# EAGLE design schematic (EAGLE 5.10)
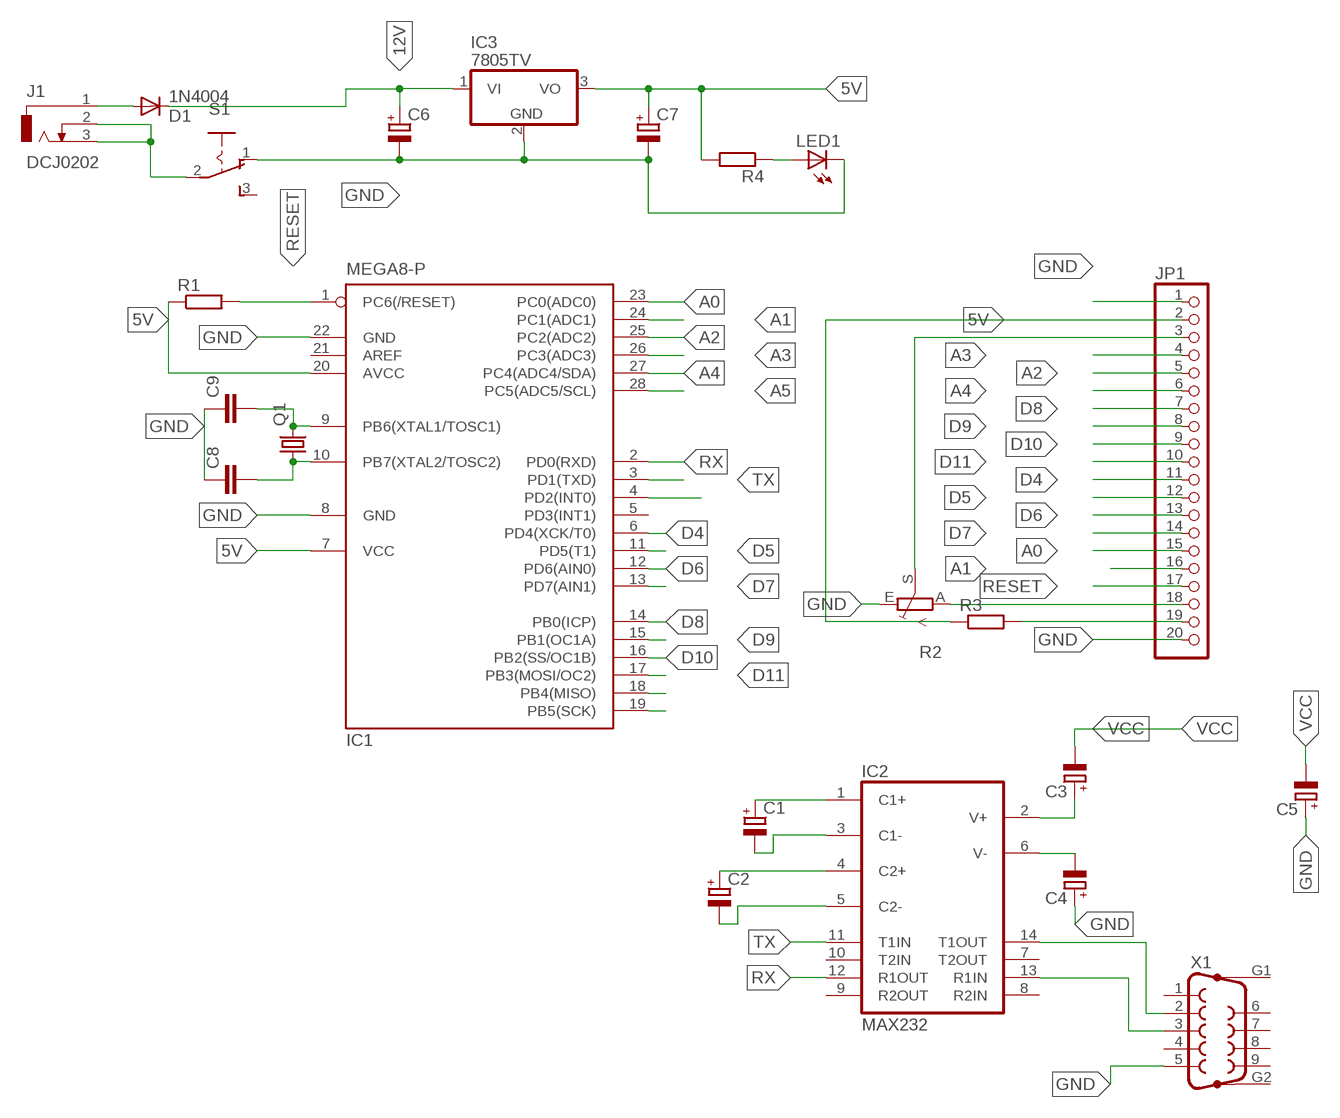
[diagram p0: schematic, sheet 1]

## Parts
C1  CPOL-EUE2-5  [E2-5]
C2  CPOL-EUE2-5  [E2-5]
C3  CPOL-EUE2-5  [E2-5]
C4  CPOL-EUE2-5  [E2-5]
C5  CPOL-EUE2-5  [E2-5]
C6  CPOL-EUE5-6  [E5-6]
C7  CPOL-EUE5-6  [E5-6]
C8  C-EU025-024X044  [C025-024X044]
C9  C-EU025-024X044  [C025-024X044]
D1  1N4004  [DO41-10]
IC1  MEGA8-P  [DIL28-3]
IC2  MAX232  [DIL16]
IC3  7805TV  [TO220V]
J1  DCJ0202  [DCJ0202]
JP1  PINHD-1X20  [1X20]
LED1  LED3MM  [LED3MM]
Q1  CRYSTALHC49S  [HC49/S]
R1  R-EU_0207/10  [0207/10]
R2  TRIM_EU-B64Y  [B64Y]
R3  R-EU_0207/10  [0207/10]
R4  R-EU_0207/10  [0207/10]
S1  255SB  [255SB]
X1  F09HP  [F09HP]

## Nets
5V: C7.+ IC1.7(VCC) IC1.20(AVCC) IC3.3(VO) JP1.2 R1.1 R3.1 R4.2
12V: C6.+ D1.C IC3.1(VI)
A0: IC1.23(PC0(ADC0)) JP1.15
A1: IC1.24(PC1(ADC1)) JP1.16
A2: IC1.25(PC2(ADC2)) JP1.5
A3: IC1.26(PC3(ADC3)) JP1.4
A4: IC1.27(PC4(ADC4/SDA)) JP1.6
A5: IC1.28(PC5(ADC5/SCL))
D4: IC1.6(PD4(XCK/T0)) JP1.11
D5: IC1.11(PD5(T1)) JP1.12
D6: IC1.12(PD6(AIN0)) JP1.13
D7: IC1.13(PD7(AIN1)) JP1.14
D8: IC1.14(PB0(ICP)) JP1.7
D9: IC1.15(PB1(OC1A)) JP1.8
D10: IC1.16(PB2(SS/OC1B)) JP1.9
D11: IC1.17(PB3(MOSI/OC2)) JP1.10
GND: C4.+ C5.+ C6.- C7.- C8.1 C9.1 IC1.8(GND) IC1.22(GND) IC3.2(GND) JP1.1 JP1.20 LED1.K(C) R2.E S1.1(O) X1.5
N$1: C9.2 IC1.9(PB6(XTAL1/TOSC1)) Q1.2
N$2: C8.2 IC1.10(PB7(XTAL2/TOSC2)) Q1.1
N$3: C2.- IC2.5(C2-)
N$4: C2.+ IC2.4(C2+)
N$5: C1.- IC2.3(C1-)
N$6: C1.+ IC2.1(C1+)
N$7: C3.+ IC2.2(V+)
N$8: C4.- IC2.6(V-)
N$9: IC2.14(T1OUT) X1.2
N$10: IC2.13(R1IN) X1.3
N$11: D1.A J1.1
N$12: IC1.4(PD2(INT0))
N$13: LED1.A R4.1
N$15: J1.2 J1.3 S1.2(P)
N$21: JP1.18 R2.A
N$22: JP1.19 R3.2
N$24: IC1.18(PB4(MISO))
N$25: IC1.19(PB5(SCK))
POTOUT: JP1.3 R2.S
RESET: IC1.1(PC6(/RESET)) JP1.17 R1.2
RX: IC1.2(PD0(RXD)) IC2.12(R1OUT)
TX: IC1.3(PD1(TXD)) IC2.11(T1IN)
VCC: C3.- C5.-
Unconnected: IC1.5(PD3(INT1)) IC1.21(AREF) IC2.7(T2OUT) IC2.8(R2IN) IC2.9(R2OUT) IC2.10(T2IN) S1.3(S) X1.1 X1.4 X1.6 X1.7 X1.8 X1.9 X1.G1 X1.G2

## Power pins joined to a net without a drawn wire
GND: IC2.15(GND)
VCC: IC2.16(VCC)

## Library data of the parts
C1-C7 = rcl:CPOL-EU: POLARIZED CAPACITOR, European symbol
C8 C9 = rcl:C-EU: CAPACITOR, European symbol
D1 = diode:1N4004: DIODE general purpose rectifier, 1 A
IC1 = atmel:MEGA8-P: MICROCONTROLLER 8 Kbytes FLASH, 1 kbytes SRAM, 512 bytes EEPROM, USART, 4-channel 10 bit ADC, 2-channel 8 bit ADC Pin compatible with Atmega48, ATMega88, ATMega168 Source: avr.lbr
IC2 = maxim:MAX232: RS232 TRANSEIVER
IC3 = linear:78*: Positive VOLTAGE REGULATOR Source: http://cache.national.com/ds/LM/LM78L05.pdf http://www.fairchildsemi.com/ds/LM/LM7805.pdf
J1 = con-jack:DCJ0202: DC POWER JACK Source: DCJ0202.pdf
JP1 = pinhead:PINHD-1X20: PIN HEADER
LED1 = led:LED: LED OSRAM: - CHIPLED LG R971, LG N971, LY N971, LG Q971, LY Q971, LO R971, LY R971 LH N974, LH R974 LS Q976, LO Q976, LY Q976 LO Q996 - Hyper CHIPLED LW Q18S LB Q993, LB Q99A, LB R99A - SideLED LS A670, LO A670, LY A670, LG A670, LP A670 LB A673, LV A673, LT A673, LW A673 LH A674 LY A675 LS A676, LA A676, LO A676, LY A676, LW A676 LS A679, LY A679, LG A679 - Hyper Micro SIDELED® LS Y876, LA Y876, LO Y876, LY Y876 LT Y87S - SmartLED LW L88C, LW L88S LB L89C, LB L89S, LG L890 LS L89K, LO L89K, LY L89K LS L896, LA L896, LO L896, LY L896 - TOPLED LS T670, LO T670, LY T670, LG T670, LP T670 LSG T670, LSP T670, LSY T670, LOP T670, LYG T670 LG T671, LOG T671, LSG T671 LB T673, LV T673, LT T673, LW T673 LH T674 LS T676, LA T676, LO T676, LY T676, LB T676, LH T676, LSB T676, LW T676 LB T67C, LV T67C, LT T67C, LS T67K, LO T67K, LY T67K, LW E67C LS E67B, LA E67B, LO E67B, LY E67B, LB E67C, LV E67C, LT E67C LW T67C LS T679, LY T679, LG T679 LS T770, LO T770, LY T770, LG T770, LP T770 LB T773, LV T773, LT T773, LW T773 LH T774 LS E675, LA E675, LY E675, LS T675 LS T776, LA T776, LO T776, LY T776, LB T776 LHGB T686 LT T68C, LB T68C - Hyper Mini TOPLED® LB M676 - Mini TOPLED Santana® LG M470 LS M47K, LO M47K, LY M47K Source: http://www.osram.convergy.de LUXEON: - LUMILED® LXK2-PW12-R00, LXK2-PW12-S00, LXK2-PW14-U00, LXK2-PW14-V00 LXK2-PM12-R00, LXK2-PM12-S00, LXK2-PM14-U00 LXK2-PE12-Q00, LXK2-PE12-R00, LXK2-PE12-S00, LXK2-PE14-T00, LXK2-PE14-U00 LXK2-PB12-K00, LXK2-PB12-L00, LXK2-PB12-M00, LXK2-PB14-N00, LXK2-PB14-P00, LXK2-PB14-Q00 LXK2-PR12-L00, LXK2-PR12-M00, LXK2-PR14-Q00, LXK2-PR14-R00 LXK2-PD12-Q00, LXK2-PD12-R00, LXK2-PD12-S00 LXK2-PH12-R00, LXK2-PH12-S00 LXK2-PL12-P00, LXK2-PL12-Q00, LXK2-PL12-R00 Source: www.luxeon.com KINGBRIGHT: KA-3528ASYC Source: www.kingbright.com
Q1 = crystal:CRYSTAL: CRYSTAL
R1 R3 R4 = rcl:R-EU_: RESISTOR, European symbol
R2 = pot:TRIM_EU-: POTENTIOMETER
S1 = switch:255SB: SLIDING SWITCH Distributor Buerklin, 11G810
X1 = con-subd:F09HP: SUB-D

## Board
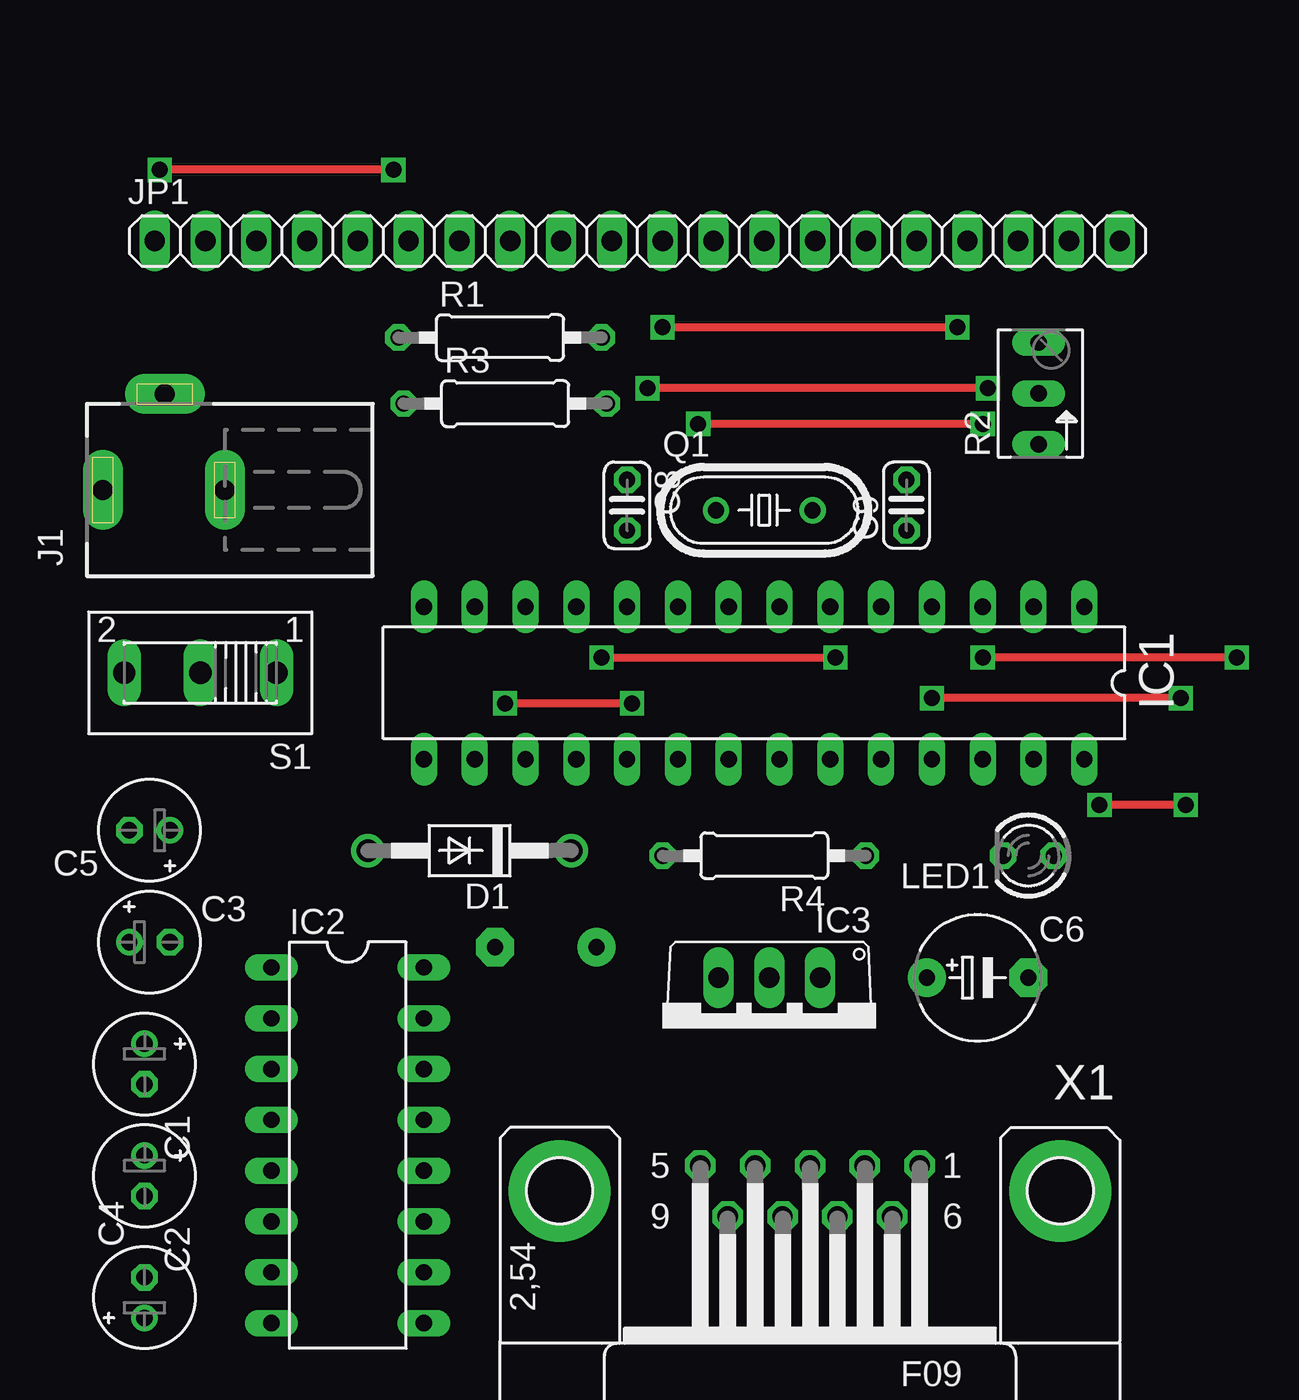
[diagram p1: board, top side]
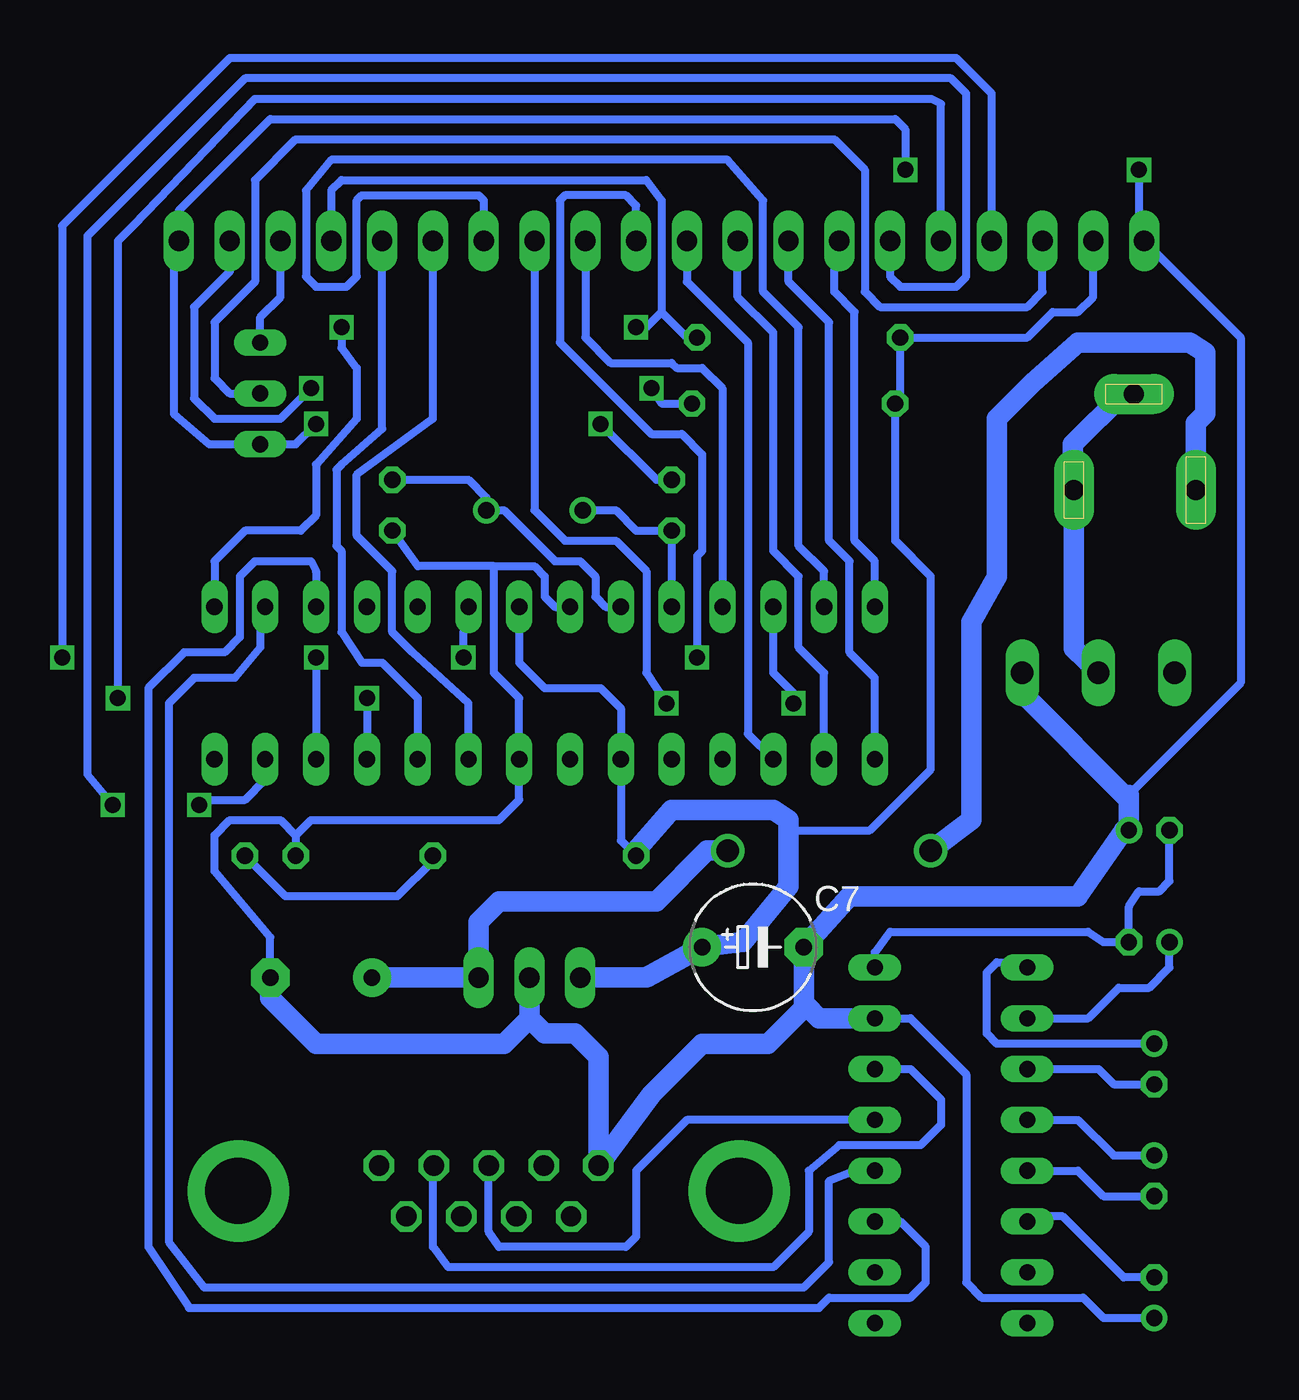
[diagram p2: board, bottom side, seen from below]

No outline drawn. Coordinates in mm, seen from the top.
Copper layers (1*16): Top 0.035mm / dielectric 1.5mm / Bottom 0.035mm
Design rules "default": minimum track width 10mil, minimum drill 24mil, track to track 8mil, track to pad 8mil, pad to pad 8mil, via to via 8mil, smd to smd 8mil, copper to edge 40mil, drill to drill 8mil, minimum pad ring 10mil, minimum via ring 8mil, stop-mask expansion 4mil, vias tented up to drill 0mil, thermal gap 10mil

### Footprints (pad centres in the part's own frame; a part is rotated, then mirrored left to right if it is on the bottom)
E2-5 = drill 0.813 pad 1.27 round: + -1.016,0 | drill 0.813 pad 1.27 octagon: - 1.016,0
E5-6 = drill 0.813 pad 1.905 round: + -2.54,0 | drill 0.813 pad 1.905 octagon: - 2.54,0
C025-024X044 = drill 0.813 octagon: 1 -1.27,0; 2 1.27,0
DO41-10 = drill 1.118 round: A 5.08,0; C -5.08,0
DIL28-3 = drill 0.813 long: 1 -16.51,-3.81; 2 -13.97,-3.81; 3 -11.43,-3.81; 4 -8.89,-3.81; 5 -6.35,-3.81; 6 -3.81,-3.81; 7 -1.27,-3.81; 8 1.27,-3.81; 9 3.81,-3.81; 10 6.35,-3.81; 11 8.89,-3.81; 12 11.43,-3.81; 13 13.97,-3.81; 14 16.51,-3.81; 15 16.51,3.81; 16 13.97,3.81; 17 11.43,3.81; 18 8.89,3.81; 19 6.35,3.81; 20 3.81,3.81; 21 1.27,3.81; 22 -1.27,3.81; 23 -3.81,3.81; 24 -6.35,3.81; 25 -8.89,3.81; 26 -11.43,3.81; 27 -13.97,3.81; 28 -16.51,3.81
DIL16 = drill 0.813 long: 1 -8.89,-3.81; 2 -6.35,-3.81; 3 -3.81,-3.81; 4 -1.27,-3.81; 5 1.27,-3.81; 6 3.81,-3.81; 7 6.35,-3.81; 8 8.89,-3.81; 9 8.89,3.81; 10 6.35,3.81; 11 3.81,3.81; 12 1.27,3.81; 13 -1.27,3.81; 14 -3.81,3.81; 15 -6.35,3.81; 16 -8.89,3.81
TO220V = drill 1.016 long: 1 -2.54,-2.54; 2 0,-2.54; 3 2.54,-2.54
DCJ0202 = drill 1 pad 2 long: 1 0,3.1; 2 4.8,0; 3 0,-3
1X20 = drill 1.016 long: 1 -24.13,0; 2 -21.59,0; 3 -19.05,0; 4 -16.51,0; 5 -13.97,0; 6 -11.43,0; 7 -8.89,0; 8 -6.35,0; 9 -3.81,0; 10 -1.27,0; 11 1.27,0; 12 3.81,0; 13 6.35,0; 14 8.89,0; 15 11.43,0; 16 13.97,0; 17 16.51,0; 18 19.05,0; 19 21.59,0; 20 24.13,0
LED3MM = drill 0.813 octagon: A -1.27,0; K 1.27,0
HC49/S = drill 0.813 round: 1 -2.413,0; 2 2.413,0
0207/10 = drill 0.813 octagon: 1 -5.08,0; 2 5.08,0
B64Y = drill 0.813 long: A 2.54,0; E -2.54,0; S 0,0
255SB = drill 1.118 long: 1 -3.81,0; 2 0,0; 3 3.81,0
F09HP = drill 1.016 octagon: 1 -5.486,-1.27; 2 -2.743,-1.27; 3 0,-1.27; 4 2.743,-1.27; 5 5.486,-1.27; 6 -4.115,1.27; 7 -1.372,1.27; 8 1.372,1.27; 9 4.115,1.27 | drill 3.302 pad 5.08 round: G1 -12.522,0; G2 12.522,0

### Placement (x,y rotation side)
C1  -155.45,33.53 270 top
C2  -155.45,27.94 270 top
C3  -155.19,39.62 0 top
C4  -155.45,21.84 90 top
C5  -155.19,45.21 180 top
C6  -113.79,37.85 0 top
C7  -135.38,39.37 0 bottom
C8  -131.32,61.47 270 top
C9  -117.35,61.47 90 top
D1  -139.19,44.2 180 top
IC1  -124.97,52.58 180 top
IC2  -145.29,29.46 270 top
IC3  -124.21,35.31 180 top
J1  -154.43,62.23 90 top
JP1  -130.81,74.68 0 top
LED1  -111.25,43.94 180 top
Q1  -124.46,61.21 0 top
R1  -137.67,69.85 0 top
R2  -110.74,67.06 90 top
R3  -137.41,66.55 0 top
R4  -124.46,43.94 180 top
S1  -152.65,53.09 180 top
X1  -122.17,27.18 180 top

### Tracks (layer width: path | path; a pad name or v marks a point on that pad's centre or on a via)
5V
  Bottom 0.406: IC1.7 -123.7,53.59 -124.97,52.32 -127.76,52.32 -128.78,51.31 IC1.20 -128.78,44.7 R4.2 | JP1.2 -152.4,71.88 -151.64,71.12 -150.37,71.12 -149.1,69.85 R1.1 -142.75,66.8 R3.1 -142.49,59.69 -144.27,57.91 -144.27,48.26 -141.22,45.21 -137.41,45.21 -137.16,44.96
  Bottom 1.016: IC3.3 -130.05,37.85 C7.+ -134.87,39.62 -137.16,42.42 -137.16,44.96 -137.16,45.72 -136.4,46.23 -131.32,46.23 -129.54,44.2 R4.2
12V
  Bottom 1.016: C6.+ IC3.1 -121.67,40.64 -122.68,41.66 -130.56,41.66 -133.1,44.2 D1.C
A0
  Bottom 0.406: -119.38,75.18 JP1.15 -119.38,65.79 -115.57,62.99 -115.57,59.94 -117.35,58.17 -117.35,55.12 -118.36,54.1 -121.16,51.56 IC1.23
A1
  Bottom 0.406: IC1.24 -118.62,51.82 -116.84,53.59 -115.82,53.59 -114.81,55.12 -114.81,59.18 -114.55,59.44 -114.55,63.25 -114.81,63.5 -116.84,65.28 JP1.16
A2  (via drill 0.8)
  Top 0.406: v-103.63,51.82 v-116.08,51.82
  Bottom 0.406: v-116.08,51.82 IC1.25 | v-103.63,51.82 -103.63,74.68 -104.39,75.44 -110.49,81.79 -144.27,81.79 -144.78,81.53 JP1.5
A3  (via drill 0.8)
  Top 0.406: v-100.84,53.85 v-113.54,53.85
  Bottom 0.406: JP1.4 -147.32,82.04 -145.54,83.82 -109.22,83.82 -100.84,75.44 v-100.84,53.85 | v-113.54,53.85 IC1.26
A4  (via drill 0.8)
  Top 0.406: v-103.38,46.48 v-107.7,46.48
  Bottom 0.406: JP1.6 -142.24,72.9 -142.75,72.39 -145.54,72.39 -146.05,72.9 -146.05,82.04 -145.29,82.8 -109.98,82.8 -102.11,74.93 -102.11,48.01 v-103.38,46.48 | v-107.7,46.48 -107.95,46.74 -109.98,46.74 -111,47.75 IC1.27
D4  (via drill 0.8)
  Top 0.406: v-132.59,53.85 v-120.9,53.85
  Bottom 0.406: JP1.11 -129.54,76.45 -129.03,76.96 -125.98,76.96 -125.73,76.71 -125.73,69.6 -130.3,65.02 -131.83,65.02 -132.84,64.01 -132.84,59.18 -132.59,58.93 v-132.59,53.85 | v-120.9,53.85 -120.9,55.12 -121.16,55.37 IC1.6
D5
  Bottom 0.406: IC1.11 -133.86,67.31 -132.84,68.33 -131.57,68.33 -131.32,68.58 -128.27,68.58 -127,69.85 JP1.12
D6  (via drill 0.8)
  Top 0.406: v-131.06,51.56 v-137.41,51.56
  Bottom 0.406: JP1.13 -124.46,61.21 -125.98,59.69 -128.52,59.69 -130.05,58.17 -130.05,53.09 v-131.06,51.56 | v-137.41,51.56 -137.41,52.07 -136.4,53.09 IC1.12
D7
  Bottom 0.406: IC1.13 -138.94,58.17 -137.67,59.44 -137.67,70.36 -135.89,72.14 -135.89,76.71 -134.11,78.74 -114.3,78.74 -113.03,77.22 -113.03,72.9 -113.54,72.39 -115.06,72.39 -115.57,72.9 -115.57,76.71 -115.82,76.96 -121.67,76.96 -121.92,76.71 JP1.14
D8
  Bottom 0.406: IC1.14 -141.48,58.67 -140.46,59.69 -140.46,71.12 -139.45,72.14 -139.45,74.42 JP1.7
D9
  Bottom 0.406: IC1.15 -141.48,52.83 -140.21,54.1 -140.21,58.67 -139.19,59.69 -139.19,70.61 -137.16,72.64 JP1.8
D10
  Bottom 0.406: IC1.16 -138.94,53.09 -137.67,54.36 -137.67,57.91 -136.4,59.18 -136.4,70.1 -134.62,71.88 JP1.9
D11
  Bottom 0.406: JP1.10 -132.08,72.64 -135.13,69.6 -135.13,50.04 IC1.17
GND  (via drill 0.8)
  Top 0.406: v-113.54,65.53 v-127.76,65.53 | v-143,78.23 v-154.69,78.23
  Bottom 0.406: -122.43,58.42 -118.62,58.42 C9.1 | C6.- -111.25,39.88 -108.46,43.18 -108.46,44.96 -109.22,45.72 -111.76,45.72 -112.52,44.96 | -112.52,44.96 LED1.K | -112.52,44.96 -113.28,45.72 -122.68,45.72 -123.7,46.74 IC1.22 -123.7,51.82 -122.43,53.09 -122.43,58.42 | -154.18,46.99 -159.77,52.58 -159.77,69.85 JP1.1 -154.69,74.93 v-154.69,78.23 | C8.1 -130.56,62.74 v-127.76,65.53 | v-113.54,65.53 -112.52,64.52 R2.E -108.2,64.52 -106.43,66.04 -106.43,74.17 JP1.20 -106.68,76.2 -111.25,80.77 -142.49,80.77 -143,80.26 v-143,78.23 | IC1.8 -125.48,56.39 -124.97,56.9 -124.97,57.91 -124.46,58.42 -122.43,58.42 | C4.+ -152.91,20.83 -151.89,21.84 -146.81,21.84 -146.05,22.61 -146.05,33.02 -143.26,35.81 -140.97,35.81
  Bottom 1.016: S1.1 -148.84,52.07 -154.18,46.74 | -154.18,46.74 C5.+ -153.92,45.21 -151.64,41.91 -140.21,41.91 C7.- -137.92,36.58 -138.05,36.45 | -154.18,46.99 -154.18,46.74 | -138.05,36.45 -138.68,35.81 -140.97,35.81 IC2.15 | -138.05,36.45 -136.14,34.54 -132.84,34.54 -130.3,32 X1.5 -127.66,33.88 -126.49,35.05 -124.97,35.05 -124.21,35.81 | -124.21,35.81 IC3.2 | -124.21,35.81 -122.94,34.54 -113.54,34.54 -111.25,36.83 C6.-
N$1
  Bottom 0.406: C9.2 -121.16,62.74 -122.05,61.85 Q1.2 -122.94,61.21 -125.48,58.67 -126.75,58.67 -127.51,57.91 -127.51,56.9 -128.02,56.39 IC1.9
N$2
  Bottom 0.406: Q1.1 -128.52,61.21 -129.54,60.2 C8.2 IC1.10
N$3
  Bottom 0.406: IC2.5 -151.64,28.19 -152.91,26.92 C2.-
N$4
  Bottom 0.406: IC2.4 -151.64,30.73 -153.42,28.96 C2.+
N$5
  Bottom 0.406: IC2.3 -152.65,33.27 -153.42,32.51 C1.-
N$6
  Bottom 0.406: C1.+ -147.57,34.54 -147.07,35.05 -147.07,38.1 -147.57,38.61 -148.84,38.61 IC2.1
N$7
  Bottom 0.406: IC2.2 -152.15,35.81 -153.67,37.34 -155.19,37.34 -156.21,38.35 C3.+
N$8
  Bottom 0.406: C4.- -153.92,22.86 -150.88,25.91 -149.35,25.91 IC2.6
N$9
  Bottom 0.406: IC2.14 -143.26,33.27 -144.78,31.75 -144.78,30.48 -143.76,29.46 -139.7,29.46 -138.18,28.19 -138.18,25.15 -136.4,23.37 -120.14,23.37 -119.38,24.38 -119.38,28.4 X1.2
N$10
  Bottom 0.406: IC2.13 -132.08,30.73 -129.54,28.19 -129.54,24.89 -129.03,24.38 -122.68,24.38 -122.17,25.15 X1.3
N$11
  Bottom 1.016: J1.1 -157.53,65.58 -157.99,66.04 -157.99,69.09 -157.23,69.6 -151.64,69.6 -149.35,67.56 -147.57,65.79 -147.57,57.91 -146.3,55.63 -146.3,45.72 D1.A
N$13
  Bottom 0.406: R4.1 -119.38,43.69 -117.6,41.91 -112.01,41.91 LED1.A
N$15
  Bottom 1.016: J1.2 -153.9,67.03 -151.38,64.52 -151.38,62.28 J1.3 -151.43,54.31 -152.02,53.72 S1.2
N$21
  Bottom 0.406: R2.A -110.74,70.87 -111.76,71.88 JP1.18
N$22  (via drill 0.8)
  Top 0.406: v-113.28,67.31 v-130.3,67.31
  Bottom 0.406: JP1.19 -109.22,73.15 -107.44,71.37 -107.44,66.8 -108.46,65.79 -111.76,65.79 v-113.28,67.31 | R3.2 -130.81,66.55 v-130.3,67.31
POTOUT
  Bottom 0.406: R2.S -109.22,67.06 -108.46,67.82 -108.46,70.61 -110.49,72.64 -110.49,77.72 -112.52,79.76 -139.45,79.76 -140.97,78.23 -140.97,72.14 -141.73,71.37 -149.1,71.37 -149.86,72.14 JP1.3
RESET  (via drill 0.8)
  Top 0.406: v-129.54,70.36 v-114.81,70.36
  Bottom 0.406: R1.2 -132.08,69.85 -130.81,71.12 | -130.81,71.12 -130.81,76.71 -130.05,77.72 -114.81,77.72 -114.3,77.22 JP1.17 | IC1.1 -108.46,58.67 -109.98,60.2 -112.78,60.2 -113.54,60.96 -113.54,63.5 -115.57,65.79 -115.57,68.33 -114.81,69.34 v-114.81,70.36 | v-129.54,70.36 -130.05,70.36 -130.81,71.12
RX
  Bottom 0.406: IC2.12 -140.46,28.19 -139.19,27.69 -139.19,23.62 -137.92,22.35 -107.95,22.35 -106.17,24.64 -106.17,51.56 -107.44,52.83 -109.47,52.83 -110.74,54.36 -110.74,56.13 IC1.2
TX
  Bottom 0.406: IC1.3 -113.54,58.17 -113.28,58.67 -110.49,58.67 -109.73,57.91 -109.73,54.86 -108.97,54.1 -106.93,54.1 -105.16,52.32 -105.16,24.38 -107.19,21.34 -138.68,21.34 -139.19,21.84 -143.26,21.84 -144.02,22.61 -144.02,24.38 -142.75,25.65 IC2.11
VCC
  Bottom 0.406: IC2.16 -141.48,39.12 -142.24,40.13 -152.15,40.13 -152.91,39.62 C3.- -154.18,41.4 -154.69,42.16 -155.7,42.16 -156.21,42.67 C5.-